# Altium project sinking-clock_LED-PCB.PrjPcb
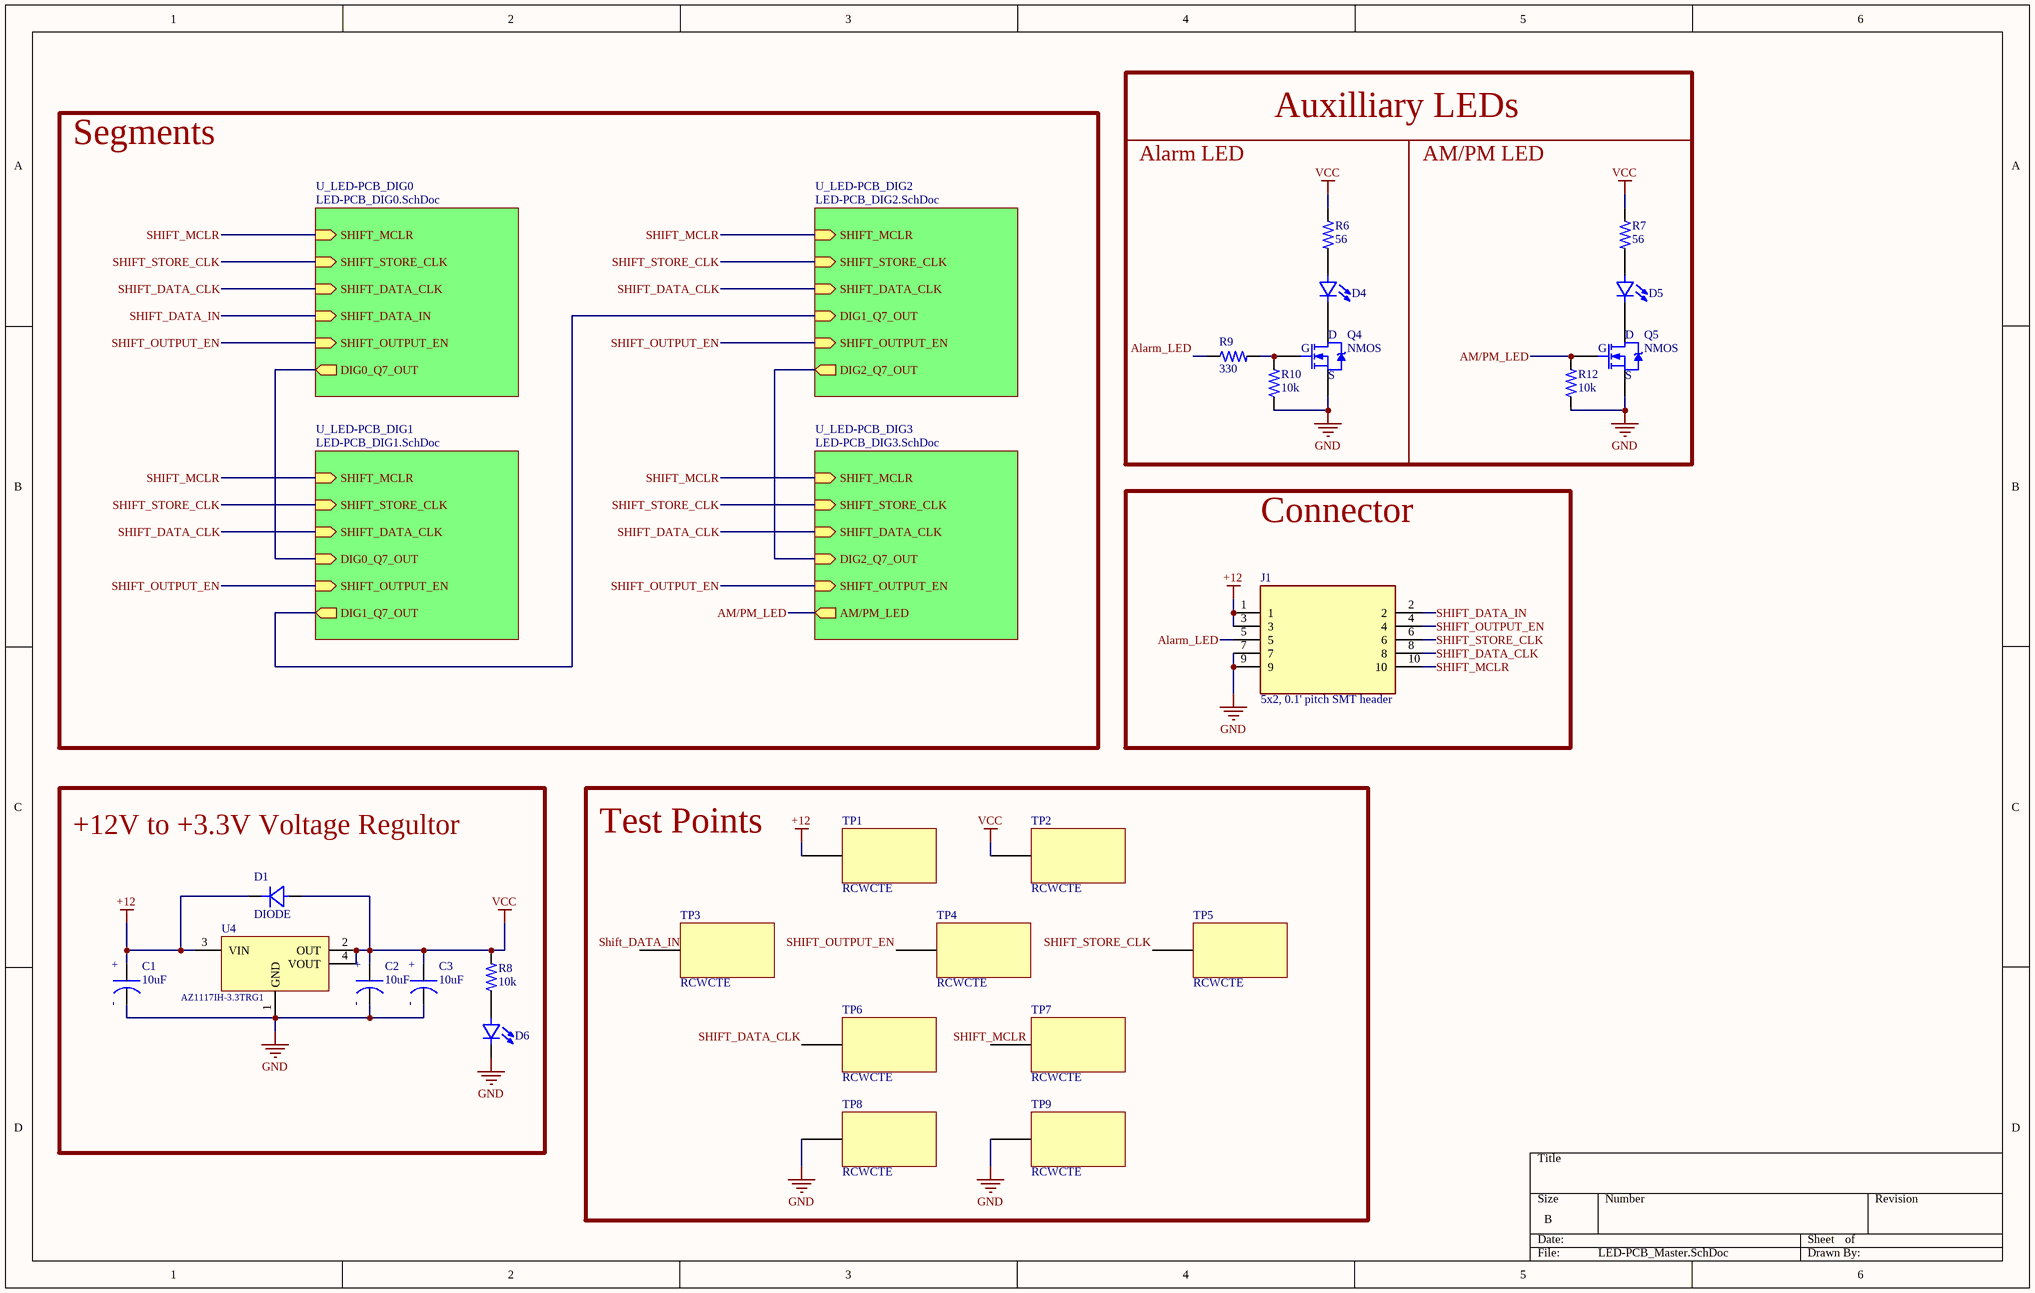
[diagram p0: LED-PCB_Master.SchDoc]
5 sheets, 148 parts. Net scope: hierarchical (ports join the sheet entries above them; power ports are global).
Board file: sinking-clock_LED-PCB.PcbDoc
Sheets:
  LED-PCB_Master.SchDoc
    U_LED-PCB_DIG0 = LED-PCB_DIG0.SchDoc
    U_LED-PCB_DIG1 = LED-PCB_DIG1.SchDoc
    U_LED-PCB_DIG2 = LED-PCB_DIG2.SchDoc
    U_LED-PCB_DIG3 = LED-PCB_DIG3.SchDoc

## Sheet LED-PCB_Master.SchDoc
size B; SheetNumber: 1; SheetTotal: 5

### Parts
C1  value 10uF  [CAP_CAN_POLY]  (hidden comment: CAP)
C2  value 10uF  [CAP_CAN_POLY]  (hidden comment: CAP)
C3  value 10uF  [CAP_CAN_POLY]  (hidden comment: CAP)
D1  DIODE  [DO-214AC]
D4  LED - single  [LED - 1204 RA]  (value not drawn)
D5  LED - single  [LED - 1204 RA]  (value not drawn)
D6  LED - single  [LED - 0603]  (value not drawn)
J1  5x2, 0.1' pitch SMT header  [5x2, 0.1' pitch SMT header]
Q4  NMOS  [SOT-23]
Q5  NMOS  [SOT-23]
R6  value 56  [0402 RES]  (hidden comment: RES)
R7  value 56  [0402 RES]  (hidden comment: RES)
R8  value 10k  [0402R]  (hidden comment: RES)
R9  value 330  [0402R]  (hidden comment: RES)
R10  value 10k  [0402R]  (hidden comment: RES)
R12  value 10k  [0402R]  (hidden comment: RES)
TP1  RCWCTE  [RCWCTE]
TP2  RCWCTE  [RCWCTE]
TP3  RCWCTE  [RCWCTE]
TP4  RCWCTE  [RCWCTE]
TP5  RCWCTE  [RCWCTE]
TP6  RCWCTE  [RCWCTE]
TP7  RCWCTE  [RCWCTE]
TP8  RCWCTE  [RCWCTE]
TP9  RCWCTE  [RCWCTE]
U4  AZ1117IH-3.3TRG1  [SOT-223-3]

### Blocks framed on the sheet
Auxilliary LEDs: D4 Q4 R6 R9 R10
AM/PM LED: D5 Q5 R7 R12
Connector: J1
+12V to +3.3V Voltage Regultor: C1-C3 D1 D6 R8 U4
Test Points: TP1-TP9

### Sub-sheets
U_LED-PCB_DIG0 = LED-PCB_DIG0.SchDoc: SHIFT_MCLR (in), SHIFT_STORE_CLK (in), SHIFT_DATA_CLK (in), SHIFT_DATA_IN (in), SHIFT_OUTPUT_EN (in), DIG0_Q7_OUT (out)
U_LED-PCB_DIG1 = LED-PCB_DIG1.SchDoc: SHIFT_MCLR (in), SHIFT_STORE_CLK (in), SHIFT_DATA_CLK (in), DIG0_Q7_OUT (in), SHIFT_OUTPUT_EN (in), DIG1_Q7_OUT (out)
U_LED-PCB_DIG2 = LED-PCB_DIG2.SchDoc: SHIFT_MCLR (in), SHIFT_STORE_CLK (in), SHIFT_DATA_CLK (in), DIG1_Q7_OUT (in), SHIFT_OUTPUT_EN (in), DIG2_Q7_OUT (out)
U_LED-PCB_DIG3 = LED-PCB_DIG3.SchDoc: SHIFT_MCLR (in), SHIFT_STORE_CLK (in), SHIFT_DATA_CLK (in), DIG2_Q7_OUT (in), SHIFT_OUTPUT_EN (in), AM/PM_LED (out)

### Nets
+12: C1.1 D1.K J1.1 J1.3 TP1.1 U4.3(VIN)
GND: C1.2 C2.2 C3.2 D6.2(C) J1.7 J1.9 Q4.2(S) Q5.2(S) R10.1 R12.1 TP8.1 TP9.1 U4.1(GND)
VCC: C2.1 C3.1 D1.A R6.1 R7.1 R8.2 TP2.1 U4.2(OUT) U4.4(VOUT)
Alarm_LED: J1.5 R9.1
AM/PM_LED: Q5.1(G) R12.2 ; sheet U_LED-PCB_DIG3/AM/PM_LED
SHIFT_DATA_CLK: J1.8 TP6.1 ; sheet U_LED-PCB_DIG0/SHIFT_DATA_CLK, sheet U_LED-PCB_DIG1/SHIFT_DATA_CLK, sheet U_LED-PCB_DIG2/SHIFT_DATA_CLK, sheet U_LED-PCB_DIG3/SHIFT_DATA_CLK
SHIFT_DATA_IN: J1.2 TP3.1 ; sheet U_LED-PCB_DIG0/SHIFT_DATA_IN
SHIFT_MCLR: J1.10 TP7.1 ; sheet U_LED-PCB_DIG0/SHIFT_MCLR, sheet U_LED-PCB_DIG1/SHIFT_MCLR, sheet U_LED-PCB_DIG2/SHIFT_MCLR, sheet U_LED-PCB_DIG3/SHIFT_MCLR
SHIFT_OUTPUT_EN: J1.4 TP4.1 ; sheet U_LED-PCB_DIG0/SHIFT_OUTPUT_EN, sheet U_LED-PCB_DIG1/SHIFT_OUTPUT_EN, sheet U_LED-PCB_DIG2/SHIFT_OUTPUT_EN, sheet U_LED-PCB_DIG3/SHIFT_OUTPUT_EN
SHIFT_STORE_CLK: J1.6 TP5.1 ; sheet U_LED-PCB_DIG0/SHIFT_STORE_CLK, sheet U_LED-PCB_DIG1/SHIFT_STORE_CLK, sheet U_LED-PCB_DIG2/SHIFT_STORE_CLK, sheet U_LED-PCB_DIG3/SHIFT_STORE_CLK
NetD4_1: D4.1(A) R6.2
NetD4_2: D4.2(C) Q4.3(D)
NetD5_1: D5.1(A) R7.2
NetD5_2: D5.2(C) Q5.3(D)
NetD6_1: D6.1(A) R8.1
NetQ4_1: Q4.1(G) R9.2 R10.2
NetU0_9: sheet U_LED-PCB_DIG0/DIG0_Q7_OUT, sheet U_LED-PCB_DIG1/DIG0_Q7_OUT
NetU1_9: sheet U_LED-PCB_DIG1/DIG1_Q7_OUT, sheet U_LED-PCB_DIG2/DIG1_Q7_OUT
NetU2_9: sheet U_LED-PCB_DIG2/DIG2_Q7_OUT, sheet U_LED-PCB_DIG3/DIG2_Q7_OUT

### Notes on the sheet
- Segments
- Alarm LED
- (in symbol CAP - POLARIZED) +; -

### Library data of the parts
C1-C3 = CAP - POLARIZED: Capacitor; MFR: Würth Elektronik; MFR PN: 865080642006; Type: SMD; Vendor: *; Vendor PN: *; Vendor Link: *; ClassName: DirectConnect
D1 = DIODE: DIODE GEN PURP; MFR: Micro Commercial Co; MFR PN: GS1M-LTP; Type: SMD; Value: *; ClassName: DirectConnect
D4 D5 = LED - single: LED; MFR: Würth Elektronik; MFR PN: 155124RS73200; Color: Red; Type: SMD; Notes: Right-Angle Sideways Mount; Vendor: *; Vendor PN: *; Vendor Link: *
D6 = LED - single: MFR PN: 5988070107F; MFR: Dialight; Color: Green; ClassName: DirectConnect
J1 = 5x2, 0.1' pitch SMT header: CONN HEADER SMD 10POS 2.54MM; MFR PN: 3020-10-0300-00; MFR: CNC Tech; ClassName: DirectConnect
Q4 Q5 = NMOS: N-Channel MOSFET; MFR PN: DMN63D8L-7; MFR: Diodes Incorporated
R6 R7 = RES: Resistor; MFR PN: RC0402FR-0756RL; MFR: YAGEO
R8 R10 R12 = RES: Resistor; MFR PN: RC0402JR-0710KL; MFR: YAGEO; Vendor: *; Vendor PN: *; Vendor Link: *
R9 = RES: Resistor; MFR PN: RC0402JR-13330RL; MFR: YAGEO; Vendor: *; Vendor PN: *; Vendor Link: *
TP1-TP9 = Test Point: MFR: KOA Speer Electronics, Inc.; Value: DNS; MFR PN: RCWCTE
U4 = AZ1117IH-3.3TRG1: IC REG LINEAR 3.3V 1A SOT223; MFR: Diodes Incorporated; MFR PN: AZ1117IH-3.3TRG1; ClassName: DirectConnect

## Sheet LED-PCB_DIG0.SchDoc
size B; SheetNumber: 2; SheetTotal: 5
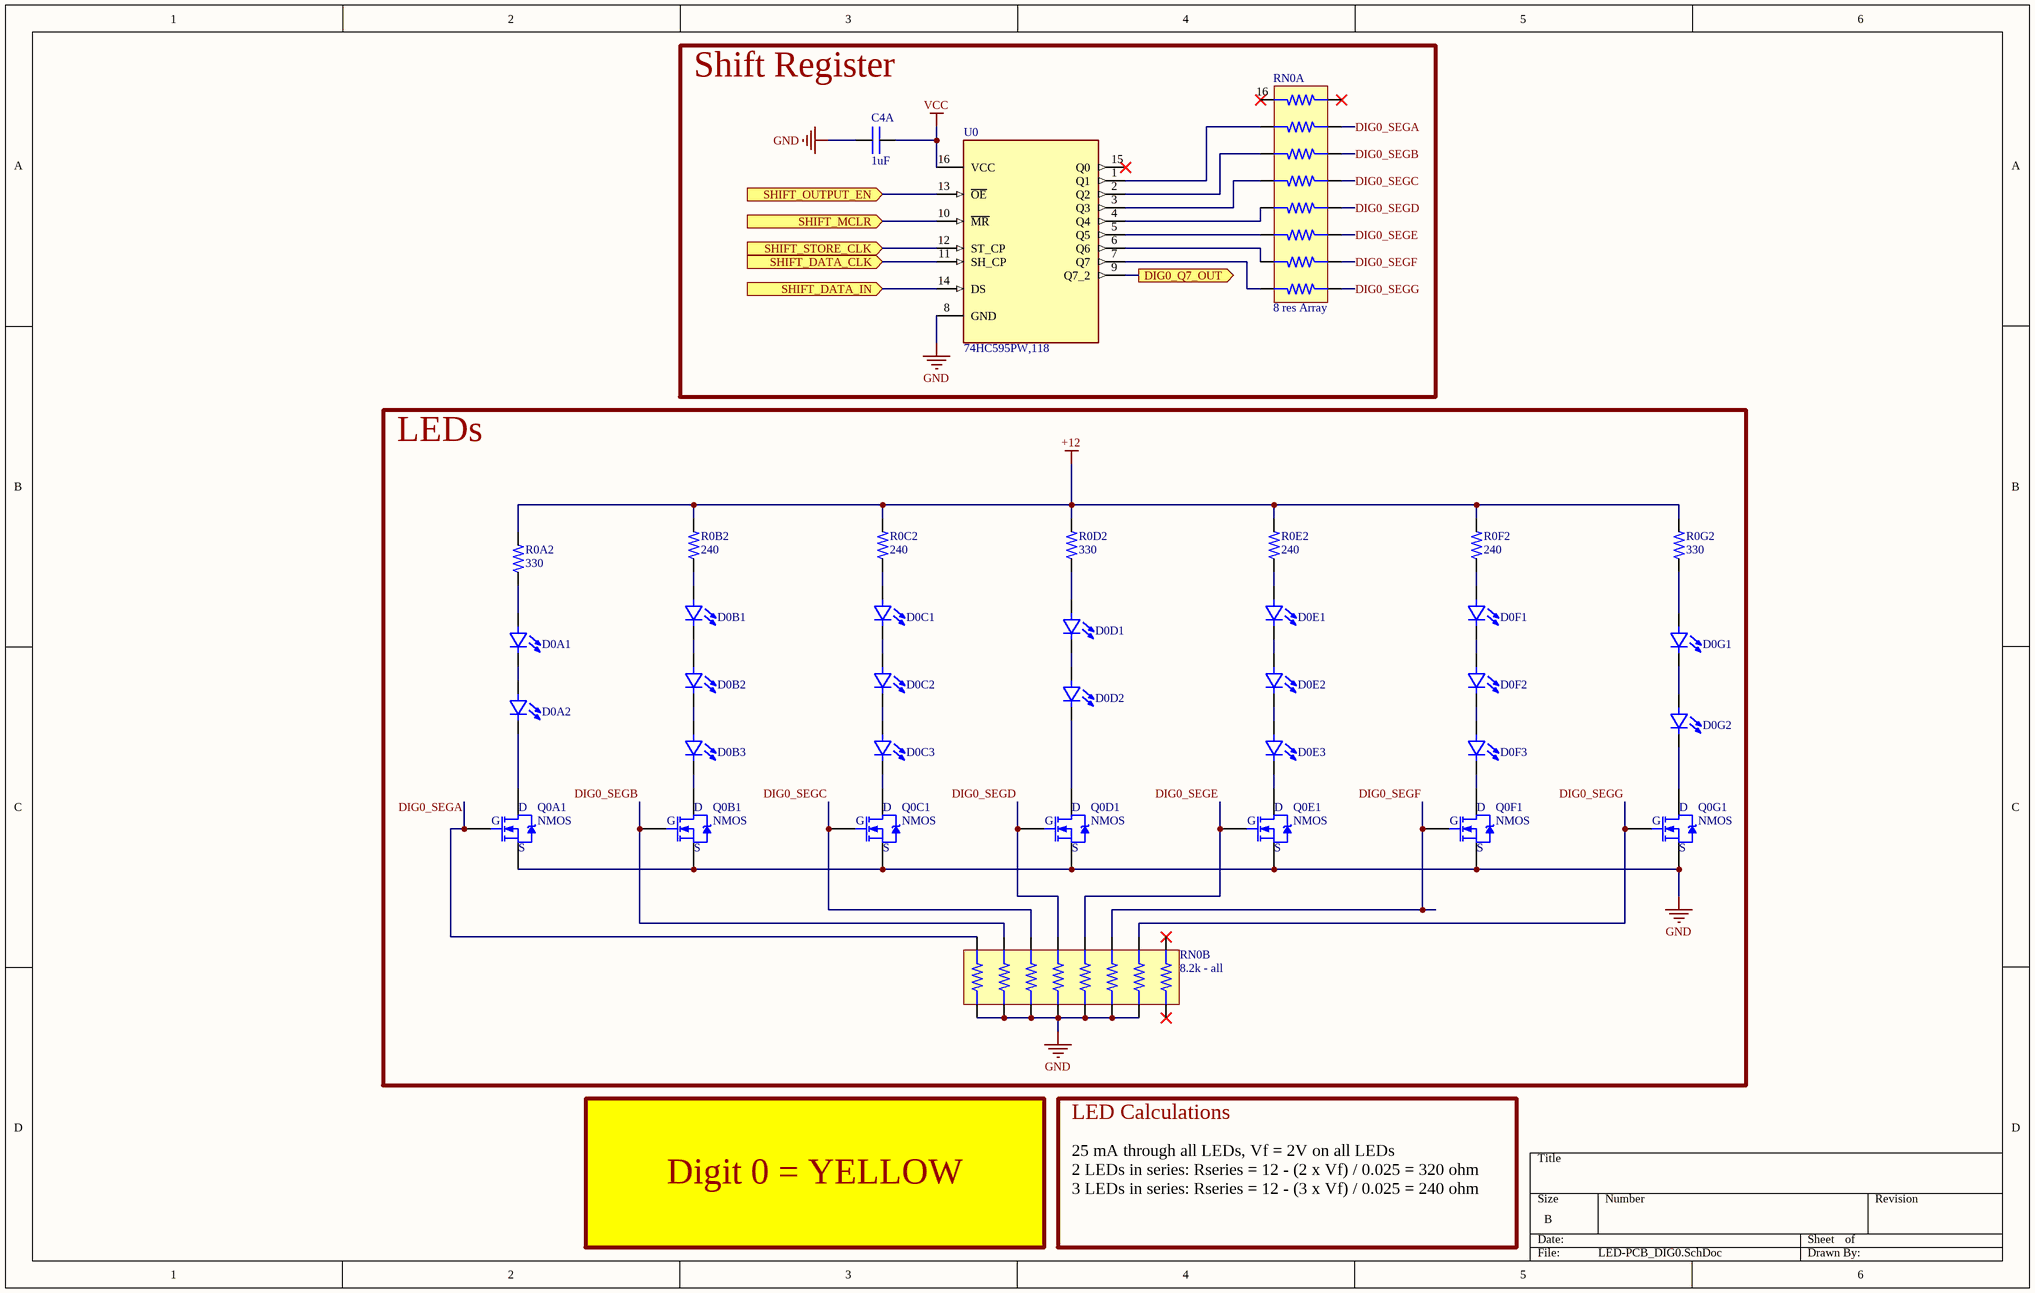
[diagram p1: LED-PCB_DIG0.SchDoc]

### Parts
C4A  value 1uF  [0402 CAP]  (hidden comment: CAP)
D0A1  LED - single  [LED - 0603]  (value not drawn)
D0A2  LED - single  [LED - 0603]  (value not drawn)
D0B1  LED - single  [LED - 0603]  (value not drawn)
D0B2  LED - single  [LED - 0603]  (value not drawn)
D0B3  LED - single  [LED - 0603]  (value not drawn)
D0C1  LED - single  [LED - 0603]  (value not drawn)
D0C2  LED - single  [LED - 0603]  (value not drawn)
D0C3  LED - single  [LED - 0603]  (value not drawn)
D0D1  LED - single  [LED - 0603]  (value not drawn)
D0D2  LED - single  [LED - 0603]  (value not drawn)
D0E1  LED - single  [LED - 0603]  (value not drawn)
D0E2  LED - single  [LED - 0603]  (value not drawn)
D0E3  LED - single  [LED - 0603]  (value not drawn)
D0F1  LED - single  [LED - 0603]  (value not drawn)
D0F2  LED - single  [LED - 0603]  (value not drawn)
D0F3  LED - single  [LED - 0603]  (value not drawn)
D0G1  LED - single  [LED - 0603]  (value not drawn)
D0G2  LED - single  [LED - 0603]  (value not drawn)
Q0A1  NMOS  [SOT-23]
Q0B1  NMOS  [SOT-23]
Q0C1  NMOS  [SOT-23]
Q0D1  NMOS  [SOT-23]
Q0E1  NMOS  [SOT-23]
Q0F1  NMOS  [SOT-23]
Q0G1  NMOS  [SOT-23]
R0A2  value 330  [0402 RES]  (hidden comment: RES)
R0B2  value 240  [0402 RES]  (hidden comment: RES)
R0C2  value 240  [0402 RES]  (hidden comment: RES)
R0D2  value 330  [0402 RES]  (hidden comment: RES)
R0E2  value 240  [0402 RES]  (hidden comment: RES)
R0F2  value 240  [0402 RES]  (hidden comment: RES)
R0G2  value 330  [0402 RES]  (hidden comment: RES)
RN0A  8 res Array  [EXB2HV331JV]
RN0B  8.2k - all  [MNR18ERAPJ822]
U0  74HC595PW,118  [16-TSSOP]

### Blocks framed on the sheet
Shift Register: C4A RN0A U0
LEDs: D0A1 D0A2 D0B1-D0B3 D0C1-D0C3 D0D1 D0D2 D0E1-D0E3 D0F1-D0F3 D0G1 D0G2 Q0A1 Q0B1 Q0C1 Q0D1 Q0E1 Q0F1 Q0G1 R0A2 R0B2 R0C2 R0D2 R0E2 R0F2 R0G2 RN0B

### Ports
DIG0_Q7_OUT (out, see LED-PCB_Master[1B], LED-PCB_DIG1[3A]), SHIFT_DATA_CLK (in, see LED-PCB_Master[1A], LED-PCB_DIG1[3A], LED-PCB_DIG2[3A], LED-PCB_DIG3[2B]), SHIFT_DATA_IN (in, see LED-PCB_Master[1A]), SHIFT_MCLR (in, see LED-PCB_Master[1A], LED-PCB_DIG1[3A], LED-PCB_DIG2[3A], LED-PCB_DIG3[2B]), SHIFT_OUTPUT_EN (in, see LED-PCB_Master[1B], LED-PCB_DIG1[3A], LED-PCB_DIG2[3A], LED-PCB_DIG3[2B]), SHIFT_STORE_CLK (in, see LED-PCB_Master[1A], LED-PCB_DIG1[3A], LED-PCB_DIG2[3A], LED-PCB_DIG3[2B])

### Nets
+12: R0A2.2 R0B2.2 R0C2.2 R0D2.2 R0E2.2 R0F2.2 R0G2.2
GND: C4A.1 Q0A1.2(S) Q0B1.2(S) Q0C1.2(S) Q0D1.2(S) Q0E1.2(S) Q0F1.2(S) Q0G1.2(S) RN0B.1 RN0B.2 RN0B.3 RN0B.4 RN0B.5 RN0B.6 RN0B.7 U0.8(GND)
VCC: C4A.2 U0.16(VCC)
DIG0_SEGA: Q0A1.1(G) RN0A.2 RN0B.16
DIG0_SEGB: Q0B1.1(G) RN0A.3 RN0B.15
DIG0_SEGC: Q0C1.1(G) RN0A.4 RN0B.14
DIG0_SEGD: Q0D1.1(G) RN0A.5 RN0B.13
DIG0_SEGE: Q0E1.1(G) RN0A.6 RN0B.12
DIG0_SEGF: Q0F1.1(G) RN0A.7 RN0B.11
DIG0_SEGG: Q0G1.1(G) RN0A.8 RN0B.10
SHIFT_DATA_CLK: U0.11(SH_CP) ; port SHIFT_DATA_CLK
SHIFT_DATA_IN: U0.14(DS) ; port SHIFT_DATA_IN
SHIFT_MCLR: U0.10(~{MR}) ; port SHIFT_MCLR
SHIFT_OUTPUT_EN: U0.13(~{OE}) ; port SHIFT_OUTPUT_EN
SHIFT_STORE_CLK: U0.12(ST_CP) ; port SHIFT_STORE_CLK
NetD0A1_1: D0A1.1(A) R0A2.1
NetD0A1_2: D0A1.2(C) D0A2.1(A)
NetD0A2_2: D0A2.2(C) Q0A1.3(D)
NetD0B1_1: D0B1.1(A) R0B2.1
NetD0B1_2: D0B1.2(C) D0B2.1(A)
NetD0B2_2: D0B2.2(C) D0B3.1(A)
NetD0B3_2: D0B3.2(C) Q0B1.3(D)
NetD0C1_1: D0C1.1(A) R0C2.1
NetD0C1_2: D0C1.2(C) D0C2.1(A)
NetD0C2_2: D0C2.2(C) D0C3.1(A)
NetD0C3_2: D0C3.2(C) Q0C1.3(D)
NetD0D1_1: D0D1.1(A) R0D2.1
NetD0D1_2: D0D1.2(C) D0D2.1(A)
NetD0D2_2: D0D2.2(C) Q0D1.3(D)
NetD0E1_1: D0E1.1(A) R0E2.1
NetD0E1_2: D0E1.2(C) D0E2.1(A)
NetD0E2_2: D0E2.2(C) D0E3.1(A)
NetD0E3_2: D0E3.2(C) Q0E1.3(D)
NetD0F1_1: D0F1.1(A) R0F2.1
NetD0F1_2: D0F1.2(C) D0F2.1(A)
NetD0F2_2: D0F2.2(C) D0F3.1(A)
NetD0F3_2: D0F3.2(C) Q0F1.3(D)
NetD0G1_1: D0G1.1(A) R0G2.1
NetD0G1_2: D0G1.2(C) D0G2.1(A)
NetD0G2_2: D0G2.2(C) Q0G1.3(D)
NetRN0A_9: RN0A.9 U0.7(Q7)
NetRN0A_10: RN0A.10 U0.6(Q6)
NetRN0A_11: RN0A.11 U0.5(Q5)
NetRN0A_12: RN0A.12 U0.4(Q4)
NetRN0A_13: RN0A.13 U0.3(Q3)
NetRN0A_14: RN0A.14 U0.2(Q2)
NetRN0A_15: RN0A.15 U0.1(Q1)
NetU0_9: U0.9(Q7_2) ; port DIG0_Q7_OUT

Not connected (* = marked no-connect by the designer): RN0A 1* 16*; RN0B 8* 9*; U0 15(Q0)*

### Notes on the sheet
- LED Calculations
- Digit 0 = YELLOW
- 25 mA through all LEDs, Vf = 2V on all LEDs
  2 LEDs in series: Rseries = 12 - (2 x Vf) / 0.025 = 320 ohm
  3 LEDs in series: Rseries = 12 - (3 x Vf) / 0.025 = 240 ohm

### Library data of the parts
C4A = CAP: Capaicitor; Part Number: CL05A105KP5NNNC
D0A1 D0A2 D0B1-D0B3 D0C1-D0C3 D0D1 D0D2 D0E1-D0E3 D0F1-D0F3 D0G1 D0G2 = LED - single: Part Number: 150060RS75000; Color: Red
Q0A1 Q0B1 Q0C1 Q0D1 Q0E1 Q0F1 Q0G1 = NMOS: N-Channel MOSFET; Part Number: DMN63D8L
R0A2 R0D2 R0G2 = RES: Resistor; Part Number: RC0402JR-13330RL
R0B2 R0C2 R0E2 R0F2 = RES: Resistor; Part Number: RC0402FR-07240RL
RN0A = 8 res Array: Value: 330; Vendor: *; Vendor PN: *; ComponentLink1Description: New link; ComponentLink1URL: *; ComponentLink2Description: New link 1; ComponentLink2URL: *; Vendor Link: *
RN0B = MNR18ERAPJ822: 8.2k Ohm ±5% 62.5mW Power Per Element Isolated 8 Resistor Network/Array ±250ppm/°C 1606, Convex, Long Side Terminals; Part Number: MNR18ERAPJ822
U0 = 74HC595PW,118: Shift Shift Register 1 Element 8 Bit 16-TSSOP; Part Number: 74HC595PW,118

## Sheet LED-PCB_DIG1.SchDoc
size B; SheetNumber: 3; SheetTotal: 5
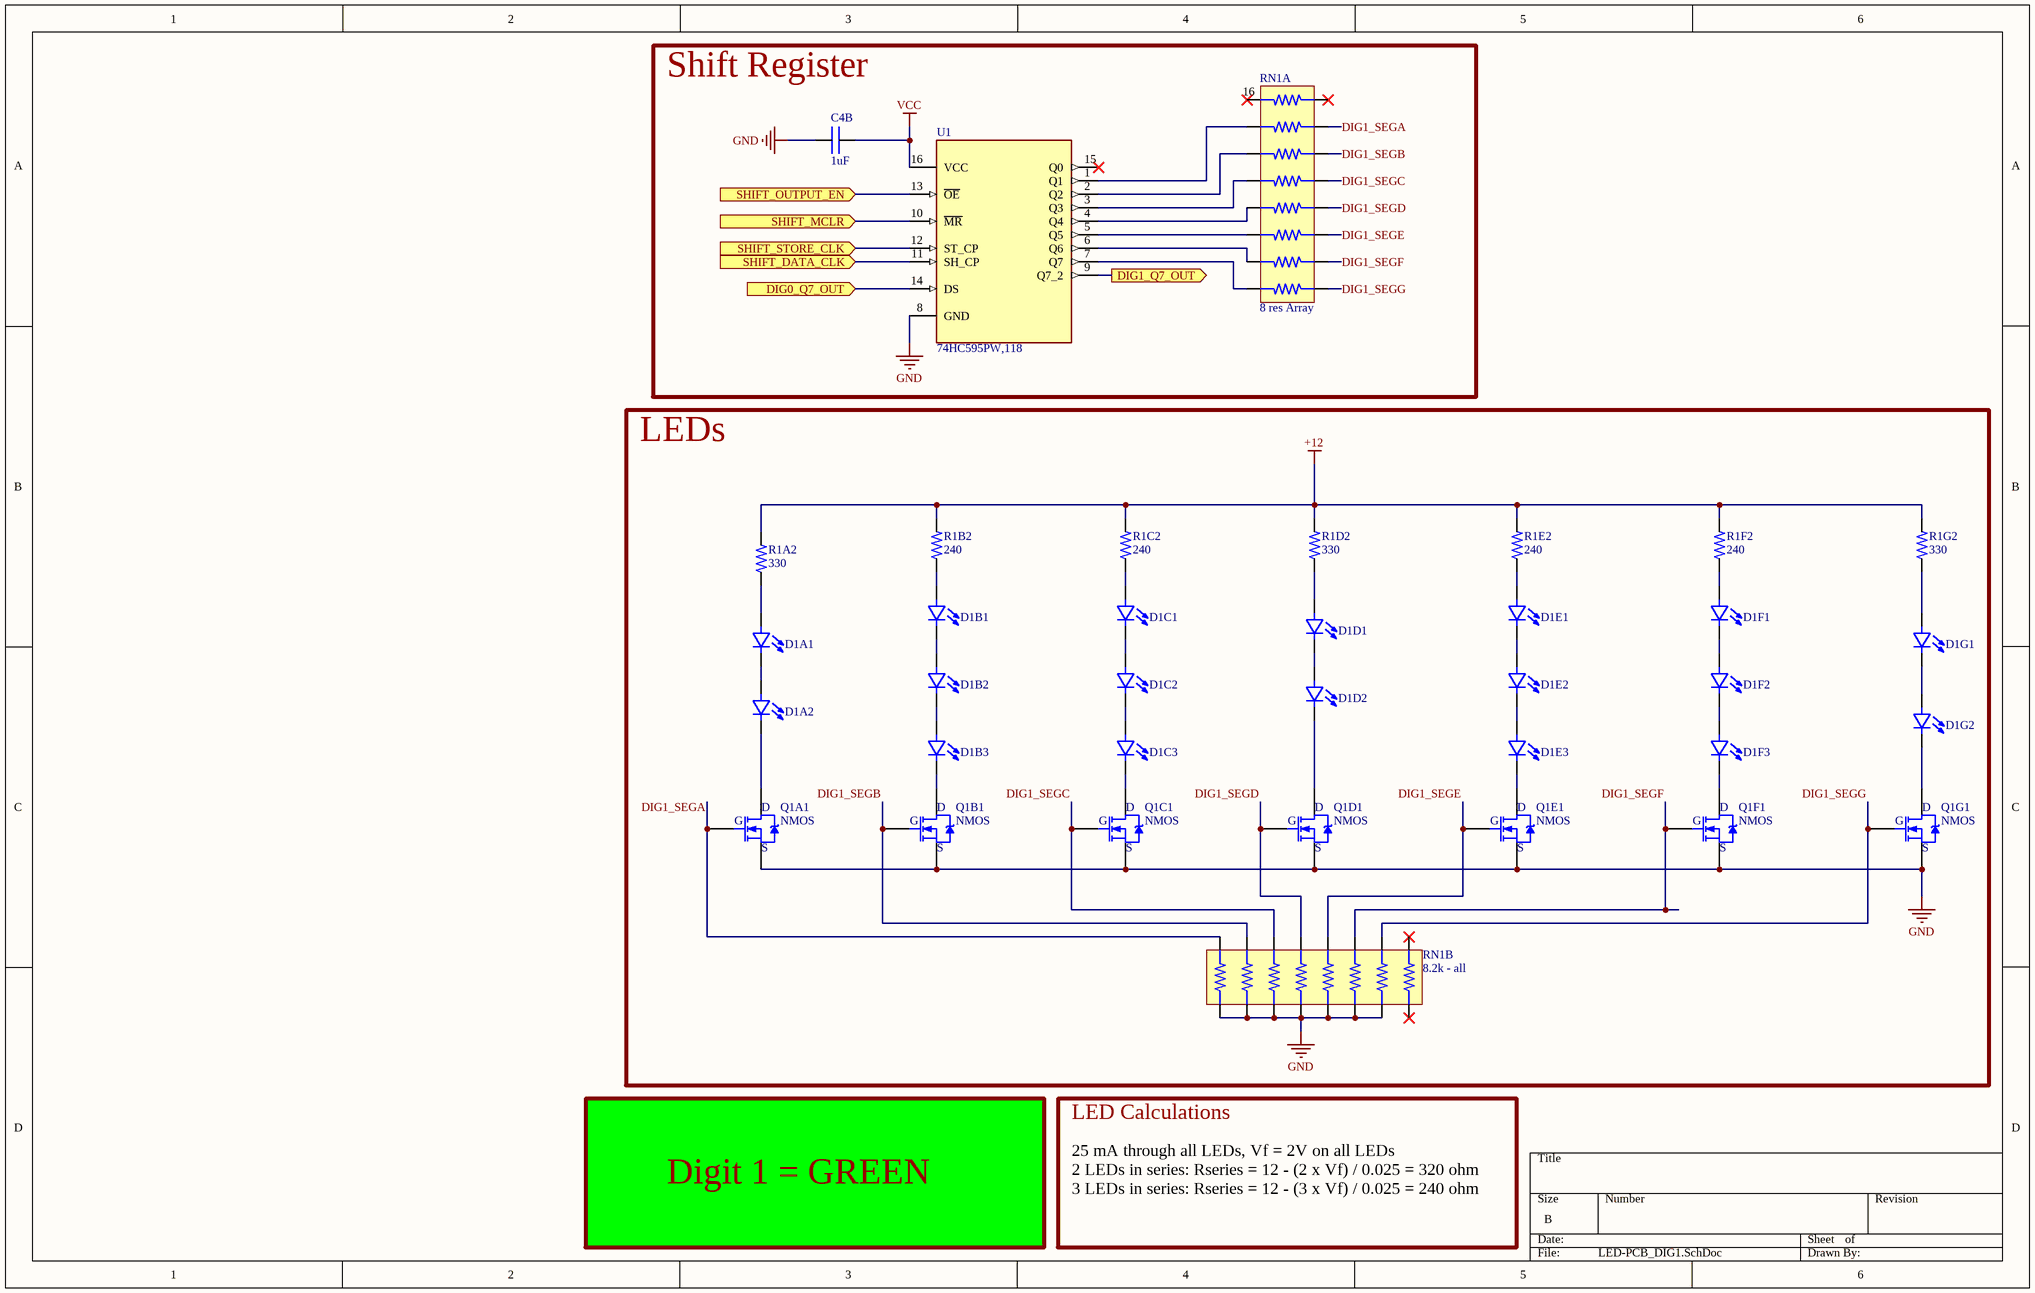
[diagram p2: LED-PCB_DIG1.SchDoc]

### Parts
C4B  value 1uF  [0402 CAP]  (hidden comment: CAP)
D1A1  LED - single  [LED - 0603]  (value not drawn)
D1A2  LED - single  [LED - 0603]  (value not drawn)
D1B1  LED - single  [LED - 0603]  (value not drawn)
D1B2  LED - single  [LED - 0603]  (value not drawn)
D1B3  LED - single  [LED - 0603]  (value not drawn)
D1C1  LED - single  [LED - 0603]  (value not drawn)
D1C2  LED - single  [LED - 0603]  (value not drawn)
D1C3  LED - single  [LED - 0603]  (value not drawn)
D1D1  LED - single  [LED - 0603]  (value not drawn)
D1D2  LED - single  [LED - 0603]  (value not drawn)
D1E1  LED - single  [LED - 0603]  (value not drawn)
D1E2  LED - single  [LED - 0603]  (value not drawn)
D1E3  LED - single  [LED - 0603]  (value not drawn)
D1F1  LED - single  [LED - 0603]  (value not drawn)
D1F2  LED - single  [LED - 0603]  (value not drawn)
D1F3  LED - single  [LED - 0603]  (value not drawn)
D1G1  LED - single  [LED - 0603]  (value not drawn)
D1G2  LED - single  [LED - 0603]  (value not drawn)
Q1A1  NMOS  [SOT-23]
Q1B1  NMOS  [SOT-23]
Q1C1  NMOS  [SOT-23]
Q1D1  NMOS  [SOT-23]
Q1E1  NMOS  [SOT-23]
Q1F1  NMOS  [SOT-23]
Q1G1  NMOS  [SOT-23]
R1A2  value 330  [0402 RES]  (hidden comment: RES)
R1B2  value 240  [0402 RES]  (hidden comment: RES)
R1C2  value 240  [0402 RES]  (hidden comment: RES)
R1D2  value 330  [0402 RES]  (hidden comment: RES)
R1E2  value 240  [0402 RES]  (hidden comment: RES)
R1F2  value 240  [0402 RES]  (hidden comment: RES)
R1G2  value 330  [0402 RES]  (hidden comment: RES)
RN1A  8 res Array  [EXB2HV331JV]
RN1B  8.2k - all  [MNR18ERAPJ822]
U1  74HC595PW,118  [16-TSSOP]

### Blocks framed on the sheet
Shift Register: C4B RN1A U1
LEDs: D1A1 D1A2 D1B1-D1B3 D1C1-D1C3 D1D1 D1D2 D1E1-D1E3 D1F1-D1F3 D1G1 D1G2 Q1A1 Q1B1 Q1C1 Q1D1 Q1E1 Q1F1 Q1G1 R1A2 R1B2 R1C2 R1D2 R1E2 R1F2 R1G2 RN1B

### Ports
DIG0_Q7_OUT (in, see LED-PCB_Master[1B], LED-PCB_DIG0[4A]), DIG1_Q7_OUT (out, see LED-PCB_Master[1B], LED-PCB_DIG2[3A]), SHIFT_DATA_CLK (in, see LED-PCB_Master[1B], LED-PCB_DIG0[3A], LED-PCB_DIG2[3A], LED-PCB_DIG3[2B]), SHIFT_MCLR (in, see LED-PCB_Master[1B], LED-PCB_DIG0[3A], LED-PCB_DIG2[3A], LED-PCB_DIG3[2B]), SHIFT_OUTPUT_EN (in, see LED-PCB_Master[1B], LED-PCB_DIG0[3A], LED-PCB_DIG2[3A], LED-PCB_DIG3[2B]), SHIFT_STORE_CLK (in, see LED-PCB_Master[1B], LED-PCB_DIG0[3A], LED-PCB_DIG2[3A], LED-PCB_DIG3[2B])

### Nets
+12: R1A2.2 R1B2.2 R1C2.2 R1D2.2 R1E2.2 R1F2.2 R1G2.2
GND: C4B.1 Q1A1.2(S) Q1B1.2(S) Q1C1.2(S) Q1D1.2(S) Q1E1.2(S) Q1F1.2(S) Q1G1.2(S) RN1B.1 RN1B.2 RN1B.3 RN1B.4 RN1B.5 RN1B.6 RN1B.7 U1.8(GND)
VCC: C4B.2 U1.16(VCC)
DIG1_SEGA: Q1A1.1(G) RN1A.2 RN1B.16
DIG1_SEGB: Q1B1.1(G) RN1A.3 RN1B.15
DIG1_SEGC: Q1C1.1(G) RN1A.4 RN1B.14
DIG1_SEGD: Q1D1.1(G) RN1A.5 RN1B.13
DIG1_SEGE: Q1E1.1(G) RN1A.6 RN1B.12
DIG1_SEGF: Q1F1.1(G) RN1A.7 RN1B.11
DIG1_SEGG: Q1G1.1(G) RN1A.8 RN1B.10
SHIFT_DATA_CLK: U1.11(SH_CP) ; port SHIFT_DATA_CLK
SHIFT_MCLR: U1.10(~{MR}) ; port SHIFT_MCLR
SHIFT_OUTPUT_EN: U1.13(~{OE}) ; port SHIFT_OUTPUT_EN
SHIFT_STORE_CLK: U1.12(ST_CP) ; port SHIFT_STORE_CLK
NetD1A1_1: D1A1.1(A) R1A2.1
NetD1A1_2: D1A1.2(C) D1A2.1(A)
NetD1A2_2: D1A2.2(C) Q1A1.3(D)
NetD1B1_1: D1B1.1(A) R1B2.1
NetD1B1_2: D1B1.2(C) D1B2.1(A)
NetD1B2_2: D1B2.2(C) D1B3.1(A)
NetD1B3_2: D1B3.2(C) Q1B1.3(D)
NetD1C1_1: D1C1.1(A) R1C2.1
NetD1C1_2: D1C1.2(C) D1C2.1(A)
NetD1C2_2: D1C2.2(C) D1C3.1(A)
NetD1C3_2: D1C3.2(C) Q1C1.3(D)
NetD1D1_1: D1D1.1(A) R1D2.1
NetD1D1_2: D1D1.2(C) D1D2.1(A)
NetD1D2_2: D1D2.2(C) Q1D1.3(D)
NetD1E1_1: D1E1.1(A) R1E2.1
NetD1E1_2: D1E1.2(C) D1E2.1(A)
NetD1E2_2: D1E2.2(C) D1E3.1(A)
NetD1E3_2: D1E3.2(C) Q1E1.3(D)
NetD1F1_1: D1F1.1(A) R1F2.1
NetD1F1_2: D1F1.2(C) D1F2.1(A)
NetD1F2_2: D1F2.2(C) D1F3.1(A)
NetD1F3_2: D1F3.2(C) Q1F1.3(D)
NetD1G1_1: D1G1.1(A) R1G2.1
NetD1G1_2: D1G1.2(C) D1G2.1(A)
NetD1G2_2: D1G2.2(C) Q1G1.3(D)
NetRN1A_9: RN1A.9 U1.7(Q7)
NetRN1A_10: RN1A.10 U1.6(Q6)
NetRN1A_11: RN1A.11 U1.5(Q5)
NetRN1A_12: RN1A.12 U1.4(Q4)
NetRN1A_13: RN1A.13 U1.3(Q3)
NetRN1A_14: RN1A.14 U1.2(Q2)
NetRN1A_15: RN1A.15 U1.1(Q1)
NetU0_9: U1.14(DS) ; port DIG0_Q7_OUT
NetU1_9: U1.9(Q7_2) ; port DIG1_Q7_OUT

Not connected (* = marked no-connect by the designer): RN1A 1* 16*; RN1B 8* 9*; U1 15(Q0)*

### Notes on the sheet
- LED Calculations
- Digit 1 = GREEN
- 25 mA through all LEDs, Vf = 2V on all LEDs
  2 LEDs in series: Rseries = 12 - (2 x Vf) / 0.025 = 320 ohm
  3 LEDs in series: Rseries = 12 - (3 x Vf) / 0.025 = 240 ohm

### Library data of the parts
C4B = CAP: Capaicitor; Part Number: CL05A105KP5NNNC
D1A1 D1A2 D1B1-D1B3 D1C1-D1C3 D1D1 D1D2 D1E1-D1E3 D1F1-D1F3 D1G1 D1G2 = LED - single: Part Number: 150060RS75000; Color: Red
Q1A1 Q1B1 Q1C1 Q1D1 Q1E1 Q1F1 Q1G1 = NMOS: N-Channel MOSFET; Part Number: DMN63D8L
R1A2 R1D2 R1G2 = RES: Resistor; Part Number: RC0402JR-13330RL
R1B2 R1C2 R1E2 R1F2 = RES: Resistor; Part Number: RC0402FR-07240RL
RN1A = 8 res Array: Value: 330; Vendor: *; Vendor PN: *; ComponentLink1Description: New link; ComponentLink1URL: *; ComponentLink2Description: New link 1; ComponentLink2URL: *; Vendor Link: *
RN1B = MNR18ERAPJ822: as RN0B on sheet LED-PCB_DIG0; Part Number: MNR18ERAPJ822
U1 = 74HC595PW,118: as U0 on sheet LED-PCB_DIG0; Part Number: 74HC595PW,118

## Sheet LED-PCB_DIG2.SchDoc
size B; SheetNumber: 4; SheetTotal: 5
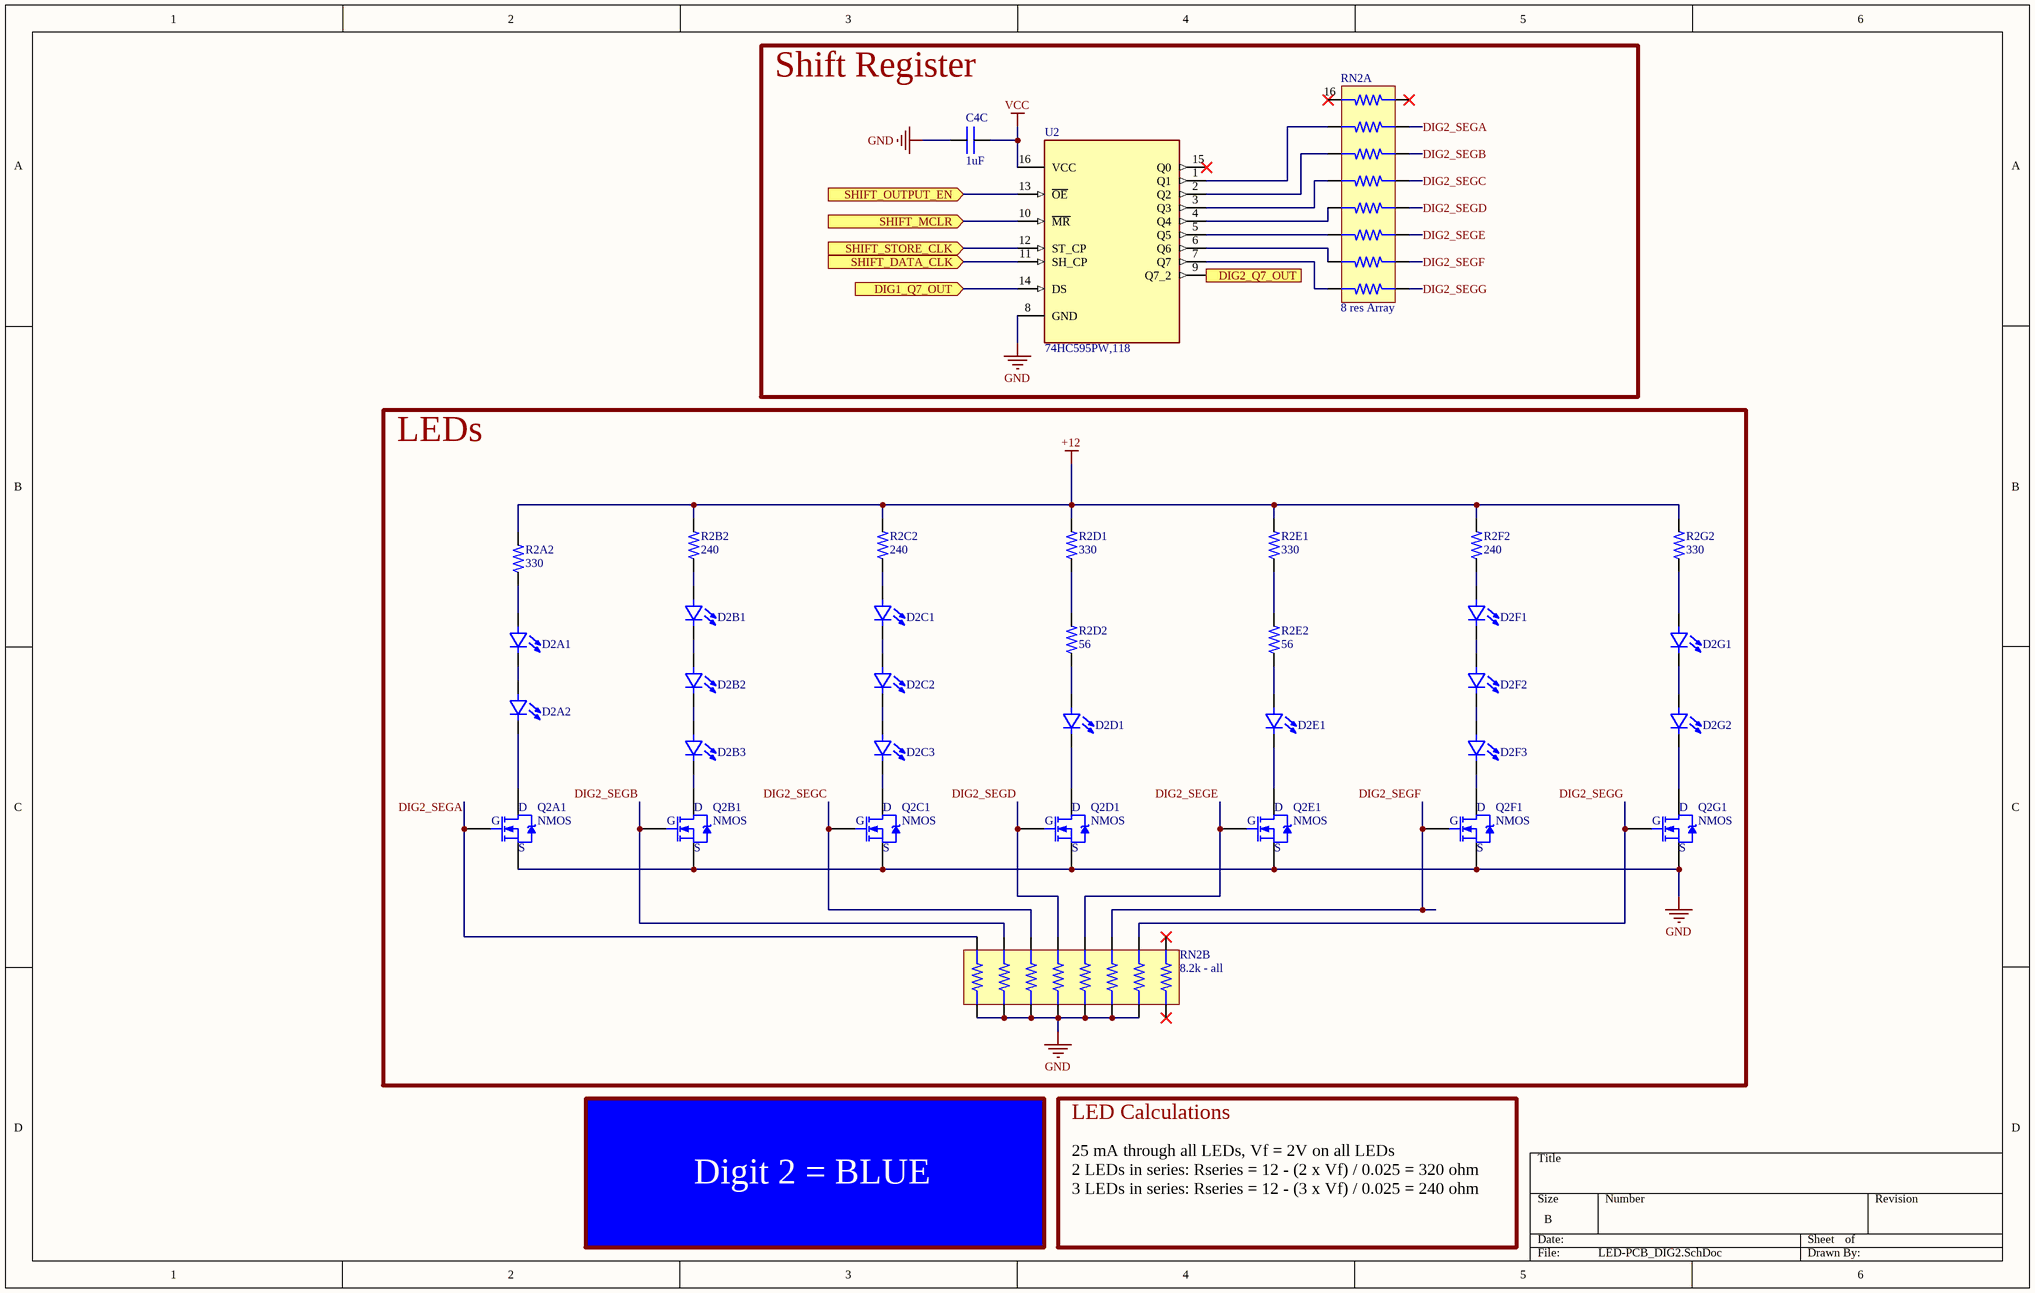
[diagram p3: LED-PCB_DIG2.SchDoc]

### Parts
C4C  value 1uF  [0402 CAP]  (hidden comment: CAP)
D2A1  LED - single  [LED - 0603]  (value not drawn)
D2A2  LED - single  [LED - 0603]  (value not drawn)
D2B1  LED - single  [LED - 0603]  (value not drawn)
D2B2  LED - single  [LED - 0603]  (value not drawn)
D2B3  LED - single  [LED - 0603]  (value not drawn)
D2C1  LED - single  [LED - 0603]  (value not drawn)
D2C2  LED - single  [LED - 0603]  (value not drawn)
D2C3  LED - single  [LED - 0603]  (value not drawn)
D2D1  LED - single  [LED - 0603]  (value not drawn)
D2E1  LED - single  [LED - 0603]  (value not drawn)
D2F1  LED - single  [LED - 0603]  (value not drawn)
D2F2  LED - single  [LED - 0603]  (value not drawn)
D2F3  LED - single  [LED - 0603]  (value not drawn)
D2G1  LED - single  [LED - 0603]  (value not drawn)
D2G2  LED - single  [LED - 0603]  (value not drawn)
Q2A1  NMOS  [SOT-23]
Q2B1  NMOS  [SOT-23]
Q2C1  NMOS  [SOT-23]
Q2D1  NMOS  [SOT-23]
Q2E1  NMOS  [SOT-23]
Q2F1  NMOS  [SOT-23]
Q2G1  NMOS  [SOT-23]
R2A2  value 330  [0402 RES]  (hidden comment: RES)
R2B2  value 240  [0402 RES]  (hidden comment: RES)
R2C2  value 240  [0402 RES]  (hidden comment: RES)
R2D1  value 330  [0402 RES]  (hidden comment: RES)
R2D2  value 56  [0402 RES]  (hidden comment: RES)
R2E1  value 330  [0402 RES]  (hidden comment: RES)
R2E2  value 56  [0402 RES]  (hidden comment: RES)
R2F2  value 240  [0402 RES]  (hidden comment: RES)
R2G2  value 330  [0402 RES]  (hidden comment: RES)
RN2A  8 res Array  [EXB2HV331JV]
RN2B  8.2k - all  [MNR18ERAPJ822]
U2  74HC595PW,118  [16-TSSOP]

### Blocks framed on the sheet
Shift Register: C4C RN2A U2
LEDs: D2A1 D2A2 D2B1-D2B3 D2C1-D2C3 D2D1 D2E1 D2F1-D2F3 D2G1 D2G2 Q2A1 Q2B1 Q2C1 Q2D1 Q2E1 Q2F1 Q2G1 R2A2 R2B2 R2C2 R2D1 R2D2 R2E1 R2E2 R2F2 R2G2 RN2B

### Ports
DIG1_Q7_OUT (in, see LED-PCB_Master[3A], LED-PCB_DIG1[4A]), DIG2_Q7_OUT (out, see LED-PCB_Master[3B], LED-PCB_DIG3[2B]), SHIFT_DATA_CLK (in, see LED-PCB_Master[3A], LED-PCB_DIG0[3A], LED-PCB_DIG1[3A], LED-PCB_DIG3[2B]), SHIFT_MCLR (in, see LED-PCB_Master[3A], LED-PCB_DIG0[3A], LED-PCB_DIG1[3A], LED-PCB_DIG3[2B]), SHIFT_OUTPUT_EN (in, see LED-PCB_Master[3B], LED-PCB_DIG0[3A], LED-PCB_DIG1[3A], LED-PCB_DIG3[2B]), SHIFT_STORE_CLK (in, see LED-PCB_Master[3A], LED-PCB_DIG0[3A], LED-PCB_DIG1[3A], LED-PCB_DIG3[2B])

### Nets
+12: R2A2.2 R2B2.2 R2C2.2 R2D1.2 R2E1.2 R2F2.2 R2G2.2
GND: C4C.1 Q2A1.2(S) Q2B1.2(S) Q2C1.2(S) Q2D1.2(S) Q2E1.2(S) Q2F1.2(S) Q2G1.2(S) RN2B.1 RN2B.2 RN2B.3 RN2B.4 RN2B.5 RN2B.6 RN2B.7 U2.8(GND)
VCC: C4C.2 U2.16(VCC)
DIG2_SEGA: Q2A1.1(G) RN2A.2 RN2B.16
DIG2_SEGB: Q2B1.1(G) RN2A.3 RN2B.15
DIG2_SEGC: Q2C1.1(G) RN2A.4 RN2B.14
DIG2_SEGD: Q2D1.1(G) RN2A.5 RN2B.13
DIG2_SEGE: Q2E1.1(G) RN2A.6 RN2B.12
DIG2_SEGF: Q2F1.1(G) RN2A.7 RN2B.11
DIG2_SEGG: Q2G1.1(G) RN2A.8 RN2B.10
SHIFT_DATA_CLK: U2.11(SH_CP) ; port SHIFT_DATA_CLK
SHIFT_MCLR: U2.10(~{MR}) ; port SHIFT_MCLR
SHIFT_OUTPUT_EN: U2.13(~{OE}) ; port SHIFT_OUTPUT_EN
SHIFT_STORE_CLK: U2.12(ST_CP) ; port SHIFT_STORE_CLK
NetD2A1_1: D2A1.1(A) R2A2.1
NetD2A1_2: D2A1.2(C) D2A2.1(A)
NetD2A2_2: D2A2.2(C) Q2A1.3(D)
NetD2B1_1: D2B1.1(A) R2B2.1
NetD2B1_2: D2B1.2(C) D2B2.1(A)
NetD2B2_2: D2B2.2(C) D2B3.1(A)
NetD2B3_2: D2B3.2(C) Q2B1.3(D)
NetD2C1_1: D2C1.1(A) R2C2.1
NetD2C1_2: D2C1.2(C) D2C2.1(A)
NetD2C2_2: D2C2.2(C) D2C3.1(A)
NetD2C3_2: D2C3.2(C) Q2C1.3(D)
NetD2D1_1: D2D1.1(A) R2D2.1
NetD2D1_2: D2D1.2(C) Q2D1.3(D)
NetD2E1_1: D2E1.1(A) R2E2.1
NetD2E1_2: D2E1.2(C) Q2E1.3(D)
NetD2F1_1: D2F1.1(A) R2F2.1
NetD2F1_2: D2F1.2(C) D2F2.1(A)
NetD2F2_2: D2F2.2(C) D2F3.1(A)
NetD2F3_2: D2F3.2(C) Q2F1.3(D)
NetD2G1_1: D2G1.1(A) R2G2.1
NetD2G1_2: D2G1.2(C) D2G2.1(A)
NetD2G2_2: D2G2.2(C) Q2G1.3(D)
NetR2D1_1: R2D1.1 R2D2.2
NetR2E1_1: R2E1.1 R2E2.2
NetRN2A_9: RN2A.9 U2.7(Q7)
NetRN2A_10: RN2A.10 U2.6(Q6)
NetRN2A_11: RN2A.11 U2.5(Q5)
NetRN2A_12: RN2A.12 U2.4(Q4)
NetRN2A_13: RN2A.13 U2.3(Q3)
NetRN2A_14: RN2A.14 U2.2(Q2)
NetRN2A_15: RN2A.15 U2.1(Q1)
NetU1_9: U2.14(DS) ; port DIG1_Q7_OUT
NetU2_9: U2.9(Q7_2) ; port DIG2_Q7_OUT

Not connected (* = marked no-connect by the designer): RN2A 1* 16*; RN2B 8* 9*; U2 15(Q0)*

### Notes on the sheet
- LED Calculations
- Digit 2 = BLUE
- 25 mA through all LEDs, Vf = 2V on all LEDs
  2 LEDs in series: Rseries = 12 - (2 x Vf) / 0.025 = 320 ohm
  3 LEDs in series: Rseries = 12 - (3 x Vf) / 0.025 = 240 ohm

### Library data of the parts
C4C = CAP: Capaicitor; MFR PN: CL05A105KP5NNNC; MFR: Samsung Microelectronics
D2A1 D2A2 D2B1-D2B3 D2C1-D2C3 D2D1 D2E1 D2F1-D2F3 D2G1 D2G2 = LED - single: MFR PN: 150060RS75000; MFR: Wurth Elektronik; Color: Red
Q2A1 Q2B1 Q2C1 Q2D1 Q2E1 Q2F1 Q2G1 = NMOS: as Q4 on sheet LED-PCB_Master
R2A2 R2D1 R2E1 R2G2 = RES: as R9 on sheet LED-PCB_Master
R2B2 R2C2 R2F2 = RES: Resistor; MFR PN: RC0402FR-07240RL; MFR: YAGEO
R2D2 R2E2 = RES: Resistor; Part Number: RC0402FR-0756RL
RN2A = 8 res Array: MFR PN: EXB-2HV331JV; MFR: Panasonic Microelectronics; Value: 330; Vendor: *; Vendor PN: *; ComponentLink1Description: New link; ComponentLink1URL: *; ComponentLink2Description: New link 1; ComponentLink2URL: *; Vendor Link: *
RN2B = MNR18ERAPJ822: 8.2k Ohm ±5% 62.5mW Power Per Element Isolated 8 Resistor Network/Array ±250ppm/°C 1606, Convex, Long Side Terminals; MFR: Rohm Semiconductor; MFR PN: MNR18ERAPJ822
U2 = 74HC595PW,118: as U0 on sheet LED-PCB_DIG0; MFR PN: 74HC595PW,118; Nexperia USA: *

## Sheet LED-PCB_DIG3.SchDoc
size B; SheetNumber: 5; SheetTotal: 5
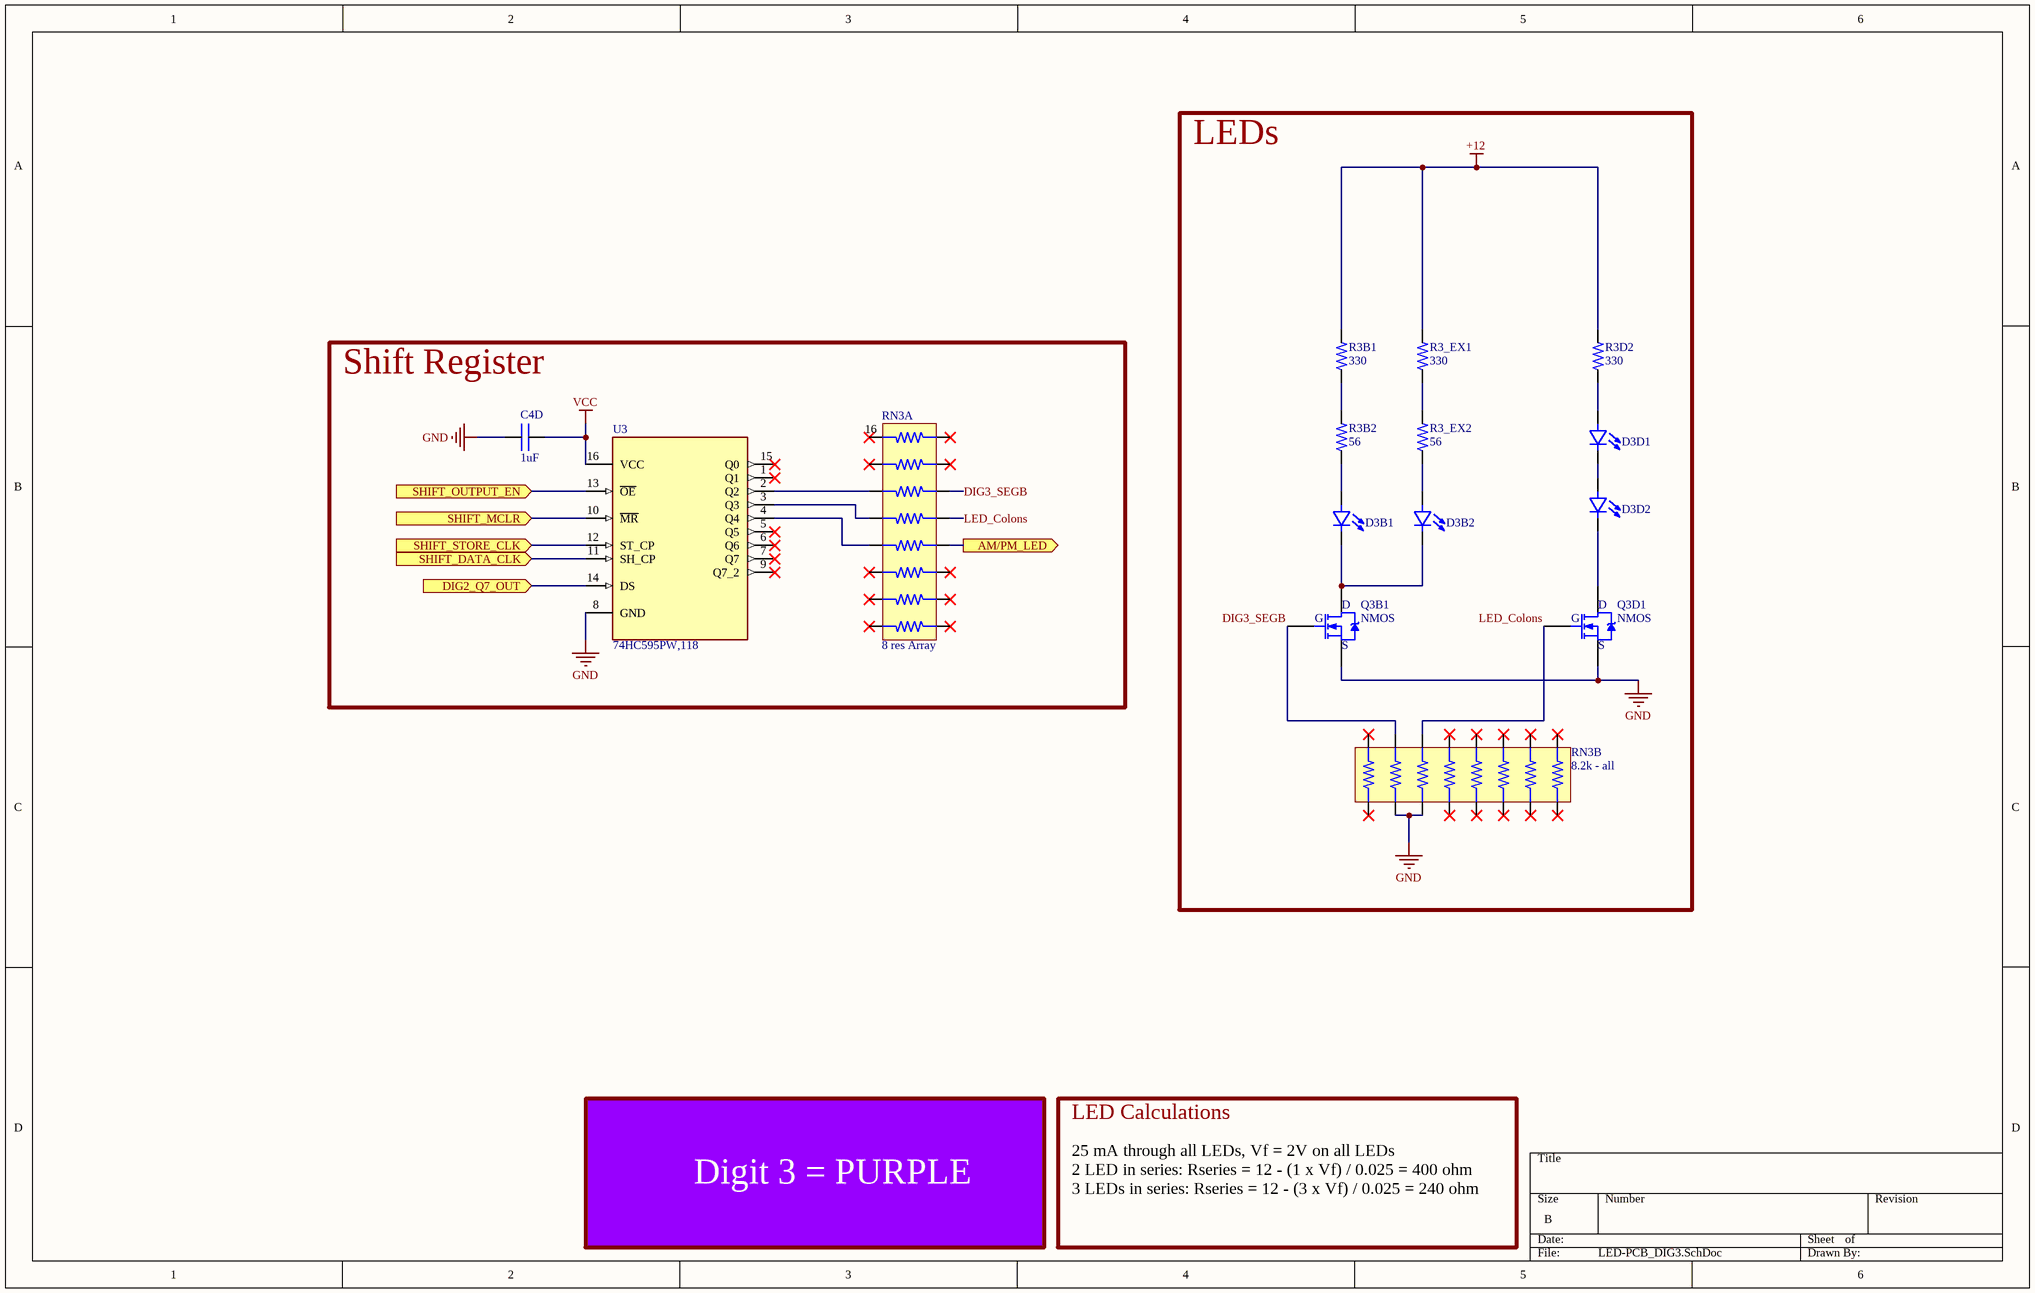
[diagram p4: LED-PCB_DIG3.SchDoc]

### Parts
C4D  value 1uF  [0402 CAP]  (hidden comment: CAP)
D3B1  LED - single  [LED - 0603]  (value not drawn)
D3B2  LED - single  [LED - 0603]  (value not drawn)
D3D1  LED - single  [LED - 0603]  (value not drawn)
D3D2  LED - single  [LED - 0603]  (value not drawn)
Q3B1  NMOS  [SOT-23]
Q3D1  NMOS  [SOT-23]
R3_EX1  value 330  [0402R]  (hidden comment: RES)
R3_EX2  value 56  [0402R]  (hidden comment: RES)
R3B1  value 330  [0402 RES]  (hidden comment: RES)
R3B2  value 56  [0402 RES]  (hidden comment: RES)
R3D2  value 330  [0402 RES]  (hidden comment: RES)
RN3A  8 res Array  [EXB2HV331JV]
RN3B  8.2k - all  [MNR18ERAPJ822]
U3  74HC595PW,118  [16-TSSOP]

### Blocks framed on the sheet
LEDs: D3B1 D3B2 D3D1 D3D2 Q3B1 Q3D1 R3_EX1 R3_EX2 R3B1 R3B2 R3D2 RN3B
Shift Register: C4D RN3A U3

### Ports
AM/PM_LED (out, see LED-PCB_Master[3B]), DIG2_Q7_OUT (in, see LED-PCB_Master[3B], LED-PCB_DIG2[4A]), SHIFT_DATA_CLK (in, see LED-PCB_Master[3B], LED-PCB_DIG0[3A], LED-PCB_DIG1[3A], LED-PCB_DIG2[3A]), SHIFT_MCLR (in, see LED-PCB_Master[3B], LED-PCB_DIG0[3A], LED-PCB_DIG1[3A], LED-PCB_DIG2[3A]), SHIFT_OUTPUT_EN (in, see LED-PCB_Master[3B], LED-PCB_DIG0[3A], LED-PCB_DIG1[3A], LED-PCB_DIG2[3A]), SHIFT_STORE_CLK (in, see LED-PCB_Master[3B], LED-PCB_DIG0[3A], LED-PCB_DIG1[3A], LED-PCB_DIG2[3A])

### Nets
+12: R3_EX1.2 R3B1.2 R3D2.2
GND: C4D.2 Q3B1.2(S) Q3D1.2(S) RN3B.2 RN3B.3 U3.8(GND)
VCC: C4D.1 U3.16(VCC)
AM/PM_LED: RN3A.5 ; port AM/PM_LED
DIG3_SEGB: Q3B1.1(G) RN3A.3 RN3B.15
LED_Colons: Q3D1.1(G) RN3A.4 RN3B.14
SHIFT_DATA_CLK: U3.11(SH_CP) ; port SHIFT_DATA_CLK
SHIFT_MCLR: U3.10(~{MR}) ; port SHIFT_MCLR
SHIFT_OUTPUT_EN: U3.13(~{OE}) ; port SHIFT_OUTPUT_EN
SHIFT_STORE_CLK: U3.12(ST_CP) ; port SHIFT_STORE_CLK
NetD3B1_1: D3B1.1(A) R3B2.1
NetD3B1_2: D3B1.2(C) D3B2.2(C) Q3B1.3(D)
NetD3B2_1: D3B2.1(A) R3_EX2.1
NetD3D1_1: D3D1.1(A) R3D2.1
NetD3D1_2: D3D1.2(C) D3D2.1(A)
NetD3D2_2: D3D2.2(C) Q3D1.3(D)
NetR3_EX1_1: R3_EX1.1 R3_EX2.2
NetR3B1_1: R3B1.1 R3B2.2
NetRN3A_12: RN3A.12 U3.4(Q4)
NetRN3A_13: RN3A.13 U3.3(Q3)
NetRN3A_14: RN3A.14 U3.2(Q2)
NetU2_9: U3.14(DS) ; port DIG2_Q7_OUT

Not connected (* = marked no-connect by the designer): RN3A 1* 2* 6* 7* 8* 9* 10* 11* 15* 16*; RN3B 1* 4* 5* 6* 7* 8* 9* 10* 11* 12* 13* 16*; U3 1(Q1)* 5(Q5)* 6(Q6)* 7(Q7)* 9(Q7_2)* 15(Q0)*

### Notes on the sheet
- LED Calculations
- Digit 3 = PURPLE
- 25 mA through all LEDs, Vf = 2V on all LEDs
  2 LED in series: Rseries = 12 - (1 x Vf) / 0.025 = 400 ohm
  3 LEDs in series: Rseries = 12 - (3 x Vf) / 0.025 = 240 ohm

### Library data of the parts
C4D = CAP: as C4C on sheet LED-PCB_DIG2
D3B1 D3B2 D3D1 D3D2 = LED - single: as D2A1 on sheet LED-PCB_DIG2
Q3B1 Q3D1 = NMOS: as Q4 on sheet LED-PCB_Master
R3_EX1 R3B1 R3D2 = RES: as R9 on sheet LED-PCB_Master
R3_EX2 R3B2 = RES: as R6 on sheet LED-PCB_Master
RN3A = 8 res Array: as RN2A on sheet LED-PCB_DIG2; Vendor: *; Vendor PN: *; ComponentLink1Description: New link; ComponentLink1URL: *; ComponentLink2Description: New link 1; ComponentLink2URL: *; Vendor Link: *
RN3B = MNR18ERAPJ822: as RN2B on sheet LED-PCB_DIG2; MFR PN: MNR18ERAPJ822
U3 = 74HC595PW,118: as U0 on sheet LED-PCB_DIG0; MFR PN: 74HC595PW,118; Nexperia USA: *

## Nets that join several sheets
+12: LED-PCB_Master (6 pins), LED-PCB_DIG0 (7 pins), LED-PCB_DIG1 (7 pins), LED-PCB_DIG2 (7 pins), LED-PCB_DIG3 (R3_EX1.2 R3B1.2 R3D2.2)
GND: LED-PCB_Master (13 pins), LED-PCB_DIG0 (16 pins), LED-PCB_DIG1 (16 pins), LED-PCB_DIG2 (16 pins), LED-PCB_DIG3 (6 pins)
VCC: LED-PCB_Master (9 pins), LED-PCB_DIG0 (C4A.2 U0.16), LED-PCB_DIG1 (C4B.2 U1.16), LED-PCB_DIG2 (C4C.2 U2.16), LED-PCB_DIG3 (C4D.1 U3.16)
AM/PM_LED: LED-PCB_Master (Q5.1 R12.2), LED-PCB_DIG3 (RN3A.5)
NetU0_9: LED-PCB_DIG0 (U0.9), LED-PCB_DIG1 (U1.14)
NetU1_9: LED-PCB_DIG1 (U1.9), LED-PCB_DIG2 (U2.14)
NetU2_9: LED-PCB_DIG2 (U2.9), LED-PCB_DIG3 (U3.14)
SHIFT_DATA_CLK: LED-PCB_Master (J1.8 TP6.1), LED-PCB_DIG0 (U0.11), LED-PCB_DIG1 (U1.11), LED-PCB_DIG2 (U2.11), LED-PCB_DIG3 (U3.11)
SHIFT_DATA_IN: LED-PCB_Master (J1.2 TP3.1), LED-PCB_DIG0 (U0.14)
SHIFT_MCLR: LED-PCB_Master (J1.10 TP7.1), LED-PCB_DIG0 (U0.10), LED-PCB_DIG1 (U1.10), LED-PCB_DIG2 (U2.10), LED-PCB_DIG3 (U3.10)
SHIFT_OUTPUT_EN: LED-PCB_Master (J1.4 TP4.1), LED-PCB_DIG0 (U0.13), LED-PCB_DIG1 (U1.13), LED-PCB_DIG2 (U2.13), LED-PCB_DIG3 (U3.13)
SHIFT_STORE_CLK: LED-PCB_Master (J1.6 TP5.1), LED-PCB_DIG0 (U0.12), LED-PCB_DIG1 (U1.12), LED-PCB_DIG2 (U2.12), LED-PCB_DIG3 (U3.12)